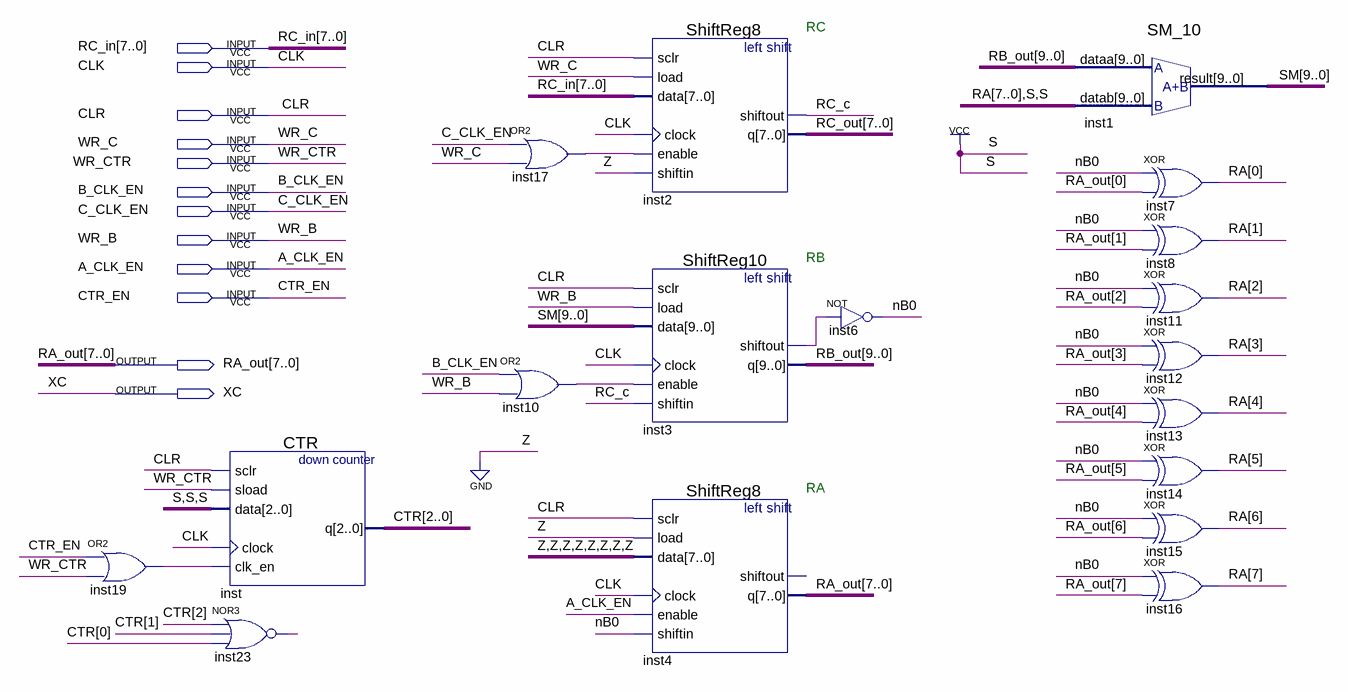
[diagram p0: schematic sheet]
// Quartus schematic ALP.bdf as structural Verilog: 18 symbols, 12 pins
module ALP (
  input  [7:0] RC_in,
  input  CLK,
  input  CLR,
  input  WR_C,
  input  WR_CTR,
  input  B_CLK_EN,
  input  C_CLK_EN,
  input  WR_B,
  input  A_CLK_EN,
  input  CTR_EN,
  output [7:0] RA_out,
  output XC
);

  wire inst3_shiftout, inst10_out, inst17_out, inst19_out, inst23_out, nB0, RC_c;
  wire [2:0] CTR;
  wire [7:0] RA, RC_out;
  wire [9:0] RB_out, SM;

  or inst19 (inst19_out, CTR_EN, WR_CTR);
  CTR inst (.sclr(CLR), .sload(WR_CTR), .data(3'b111), .clock(CLK), .clk_en(inst19_out), .q(CTR));
  nor inst23 (inst23_out, CTR[2], CTR[1], CTR[0]);
  or inst17 (inst17_out, C_CLK_EN, WR_C);
  or inst10 (inst10_out, B_CLK_EN, WR_B);
  ShiftReg8 inst2 (
    .sclr(CLR), .load(WR_C), .data(RC_in), .clock(CLK), .enable(inst17_out), .shiftin(1'b0), .shiftout(RC_c),
    .q(RC_out));
  ShiftReg10 inst3 (
    .sclr(CLR), .load(WR_B), .data(SM), .clock(CLK), .enable(inst10_out), .shiftin(RC_c),
    .shiftout(inst3_shiftout), .q(RB_out));
  ShiftReg8 inst4 (
    .sclr(CLR), .load(1'b0), .data({8{1'b0}}), .clock(CLK), .enable(A_CLK_EN), .shiftin(nB0), .q(RA_out));  // open: shiftout
  not inst6 (nB0, inst3_shiftout);
  SM_10 inst1 (.dataa(RB_out), .datab({RA, 2'b11}), .result(SM));
  xor inst7 (RA[0], nB0, RA_out[0]);
  xor inst8 (RA[1], nB0, RA_out[1]);
  xor inst11 (RA[2], nB0, RA_out[2]);
  xor inst12 (RA[3], nB0, RA_out[3]);
  xor inst13 (RA[4], nB0, RA_out[4]);
  xor inst14 (RA[5], nB0, RA_out[5]);
  xor inst15 (RA[6], nB0, RA_out[6]);
  xor inst16 (RA[7], nB0, RA_out[7]);

  // Notes on the sheet:
  //   RC
  //   RB
  //   RA
endmodule
